# EAGLE design Ethernet_Board (EAGLE 7.7.0)
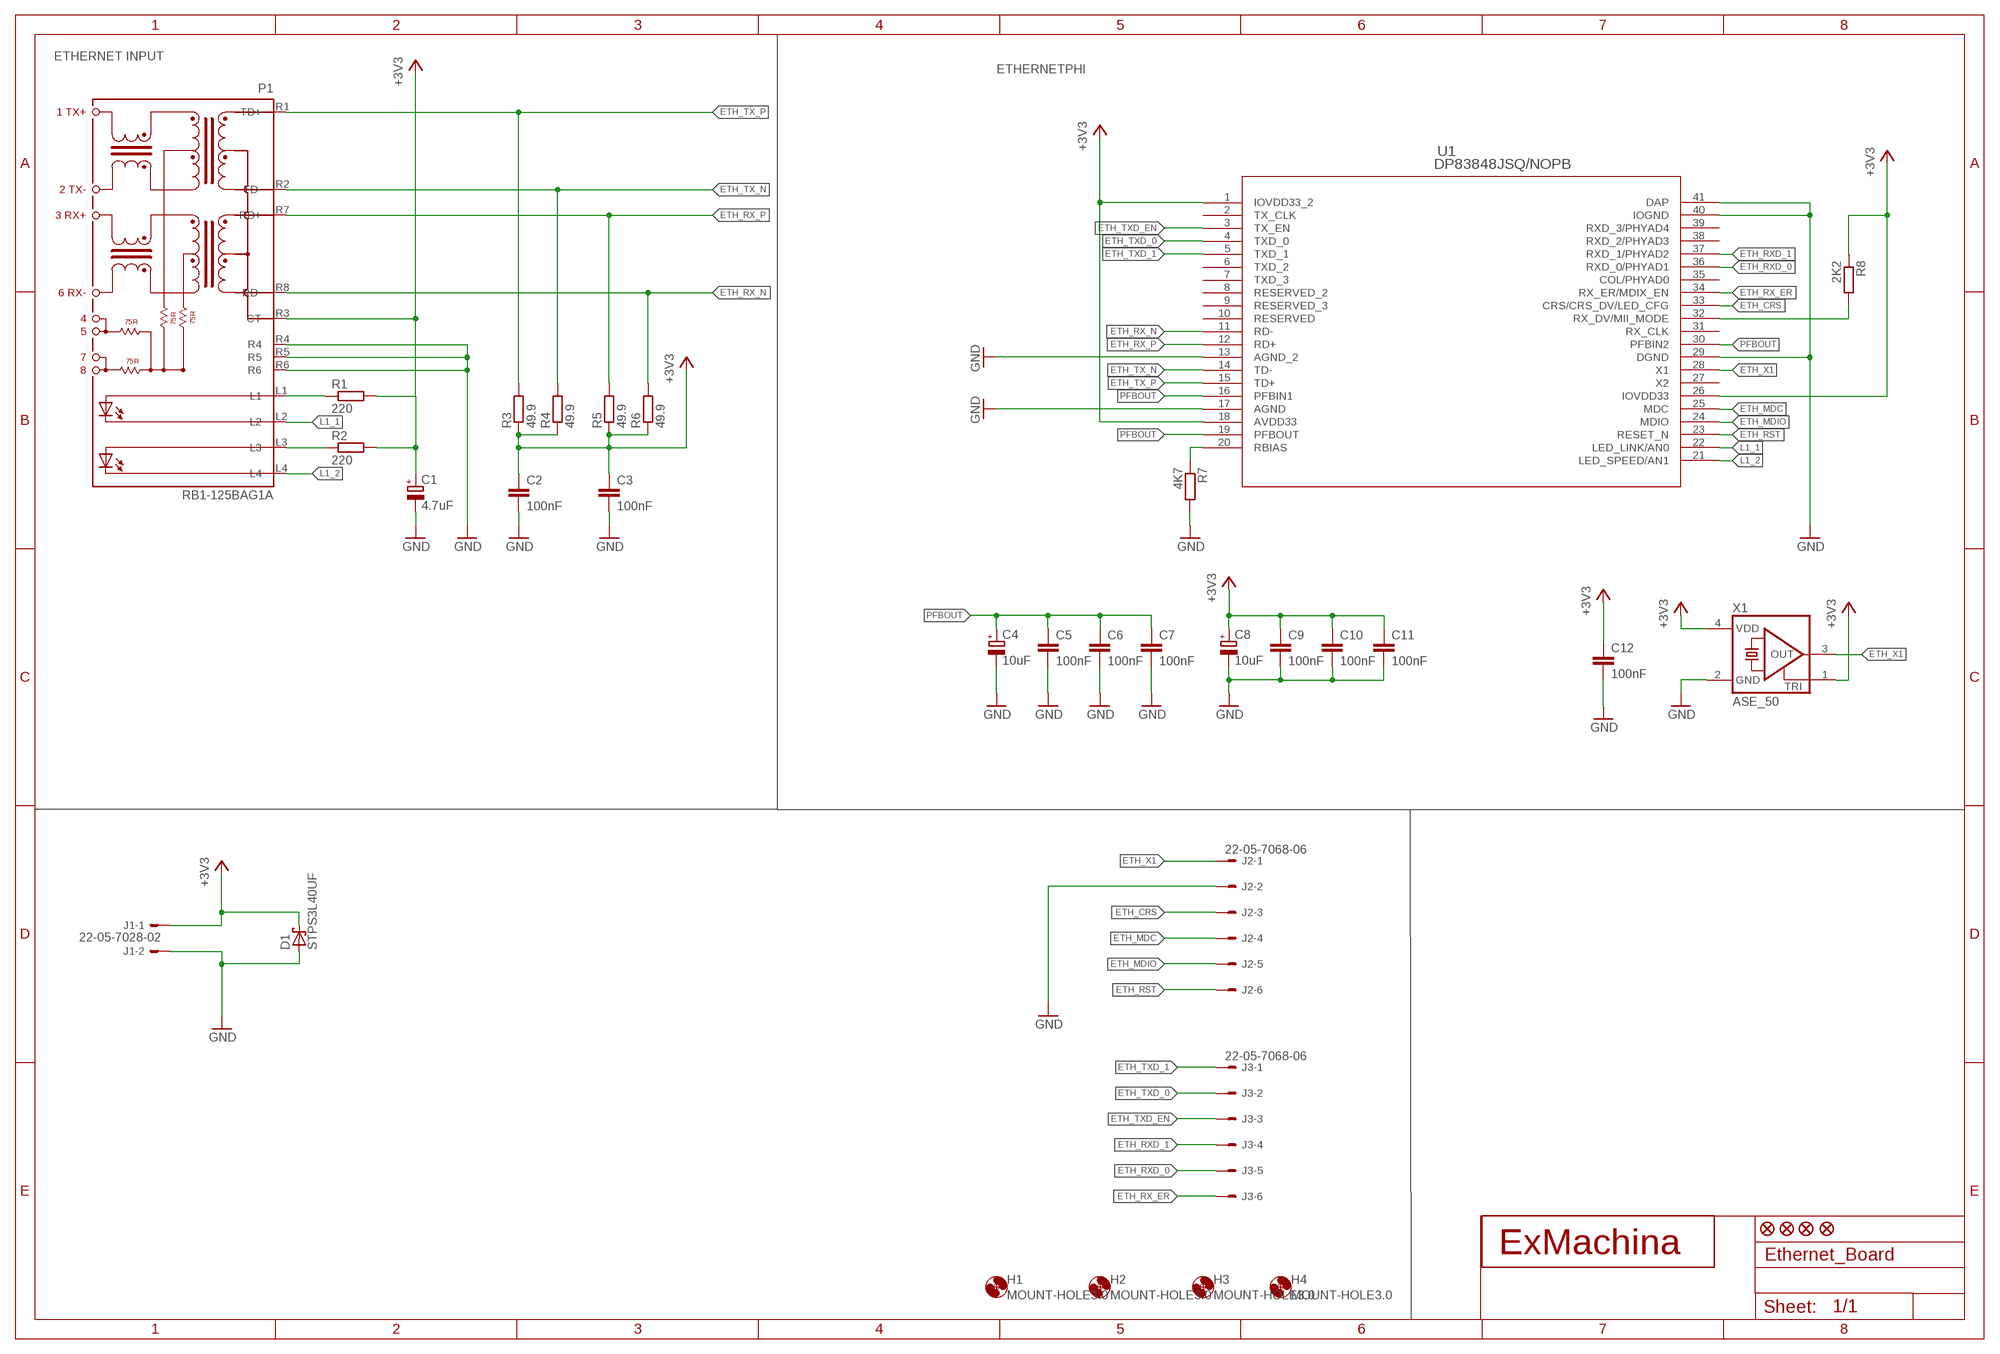
[diagram p0: schematic, sheet 1]

## Parts
C1  4.7uF  CPOL-EUCT3216  [CT3216]
C2  100nF  C-EUC0603  [C0603]
C3  100nF  C-EUC0603  [C0603]
C4  10uF  CPOL-EUCT3216  [CT3216]
C5  100nF  C-EUC0603  [C0603]
C6  100nF  C-EUC0603  [C0603]
C7  100nF  C-EUC0603  [C0603]
C8  10uF  CPOL-EUCT3216  [CT3216]
C9  100nF  C-EUC0603  [C0603]
C10  100nF  C-EUC0603  [C0603]
C11  100nF  C-EUC0603  [C0603]
C12  100nF  C-EUC0603  [C0603]
D1  STPS3L40UF  [SMB]
H1  MOUNT-HOLE3.0  [3,0]
H2  MOUNT-HOLE3.0  [3,0]
H3  MOUNT-HOLE3.0  [3,0]
H4  MOUNT-HOLE3.0  [3,0]
J1  22-05-7028-02  [7395-02]
J2  22-05-7068-06  [7395-06]
J3  22-05-7068-06  [7395-06]
JP1  FIDUCIAL1X2  [FIDUCIAL-1X2]
JP2  FIDUCIAL1X2  [FIDUCIAL-1X2]
JP3  FIDUCIAL1X2  [FIDUCIAL-1X2]
JP4  FIDUCIAL1X2  [FIDUCIAL-1X2]
P1  RB1-125BAG1A  [WIZNET_RB1-125BAG1A]
R1  220  R-EU_R0603  [R0603]
R2  220  R-EU_R0603  [R0603]
R3  49.9  R-EU_R0603  [R0603]
R4  49.9  R-EU_R0603  [R0603]
R5  49.9  R-EU_R0603  [R0603]
R6  49.9  R-EU_R0603  [R0603]
R7  4K7  R-EU_R0603  [R0603]
R8  2K2  R-EU_R0603  [R0603]
T1  EXMACHINA-LOGO-NAME  [EXM-LOGO-BASELINE]
U1  DP83848JSQ/NOPB  [SQA40B]
X1  ASE_50  ASE  [ASE]

## Nets
+3V3 [supply]: C1.+ C2.1 C3.1 C8.+ C9.1 C10.1 C11.1 C12.1 D1.C J1.1 P1.R3(CT) R1.2 R2.2 R3.1 R4.1 R5.1 R6.1 R8.1 U1.1(IOVDD33_2) U1.18(AVDD33) U1.26(IOVDD33) X1.1(TRI) X1.4(VDD)
ETH_CRS [signal]: J2.3 U1.33(CRS/CRS_DV/LED_CFG)
ETH_MDC [signal]: J2.4 U1.25(MDC)
ETH_MDIO [signal]: J2.5 U1.24(MDIO)
ETH_RST [signal]: J2.6 U1.23(RESET_N)
ETH_RX_ER [signal]: J3.6 U1.34(RX_ER/MDIX_EN)
ETH_RX_N [signal]: P1.R8(RD-) R6.2 U1.11(RD-)
ETH_RX_P [signal]: P1.R7(RD+) R5.2 U1.12(RD+)
ETH_RXD_0 [signal]: J3.5 U1.36(RXD_0/PHYAD1)
ETH_RXD_1 [signal]: J3.4 U1.37(RXD_1/PHYAD2)
ETH_TX_N [signal]: P1.R2(TD-) R4.2 U1.14(TD-)
ETH_TX_P [signal]: P1.R1(TD+) R3.2 U1.15(TD+)
ETH_TXD_0 [signal]: J3.2 U1.4(TXD_0)
ETH_TXD_1 [signal]: J3.1 U1.5(TXD_1)
ETH_TXD_EN [signal]: J3.3 U1.3(TX_EN)
ETH_X1 [signal]: J2.1 U1.28(X1) X1.3(OUT)
GND [supply]: C1.- C2.2 C3.2 C4.- C5.2 C6.2 C7.2 C8.- C9.2 C10.2 C11.2 C12.2 D1.A J1.2 J2.2 P1.R4 P1.R5 P1.R6 R7.2 U1.13(AGND_2) U1.17(AGND) U1.29(DGND) U1.40(IOGND) U1.41(DAP) X1.2(GND)
L1_1 [signal]: P1.L2 U1.22(LED_LINK/AN0)
L1_2 [signal]: P1.L4 U1.21(LED_SPEED/AN1)
MII_MODE [signal]: R8.2 U1.32(RX_DV/MII_MODE)
N$4: R7.1 U1.20(RBIAS)
N$8 [signal]: P1.L1 R1.1
N$9 [signal]: P1.L3 R2.1
PFBOUT [signal]: C4.+ C5.1 C6.1 C7.1 U1.16(PFBIN1) U1.19(PFBOUT) U1.30(PFBIN2)
Unconnected: U1.2(TX_CLK) U1.6(TXD_2) U1.7(TXD_3) U1.8(RESERVED_2) U1.9(RESERVED_3) U1.10(RESERVED) U1.27(X2) U1.31(RX_CLK) U1.35(COL/PHYAD0) U1.38(RXD_2/PHYAD3) U1.39(RXD_3/PHYAD4)

## Notes on the sheet
- ETHERNET INPUT
- ETHERNETPHI

## Library data of the parts
C1 = rcl:CPOL-EU: POLARIZED CAPACITOR, European symbol; MPN: F931A475MAA; OC_NEWARK: 58R3271
C2 C3 C5-C7 C9-C12 = rcl:C-EU: CAPACITOR, European symbol; MPN: MC0603B104K250CT; OC_NEWARK: 06R4925
C4 C8 = rcl:CPOL-EU: POLARIZED CAPACITOR, European symbol; MPN: F931A106MAA; OC_NEWARK: 58R3260
D1 = diode:STPS3L40?; MP: STMICROELECTRONICS; MPN: STPS3L40UF; OC_FARNELL: 2341599; OC_NEWARK: 06X0873
H1-H4 = holes:MOUNT-HOLE: MOUNTING HOLE with drill center marker; OC_NEWARK: unknown
J1 = con-molex:22-?-02: CONNECTOR wire to board 2.54 mm (.1 inch) pitch header; MPN: 22-05-7028; OC_FARNELL: 9731601; OC_NEWARK: 25M1728
J2 J3 = con-molex:22-?-06: CONNECTOR wire to board 2.54 mm (.1 inch) pitch header; MPN: 22-05-7068; OC_FARNELL: unknown; OC_NEWARK: 25M1733
JP1-JP4 = SparkFun:FIDUCIAL: Fiducial Alignment Points Various fiducial points for machine vision alignment.; OC_NEWARK: unknown
P1 = con-wiznet:RB1-125BAG1A: Accessory RJ-45 With Transformer Connector - UDE; OC_NEWARK: unknown
R1 R2 = rcl:R-EU_: RESISTOR, European symbol; MPN: MCMR06X2200FTL; OC_NEWARK: 86T3577
R3-R6 = rcl:R-EU_: RESISTOR, European symbol; MPN: MCMR06X49R9FTL; OC_NEWARK: 86T3659
R7 = rcl:R-EU_: RESISTOR, European symbol; MPN: MCMR06X4701FTL; OC_NEWARK: 86T3649
R8 = rcl:R-EU_: RESISTOR, European symbol; MPN: MCMR06X2201FTL; OC_NEWARK: 86T3578
T1 = exmachina:EXMACHINA-LOGO; OC_NEWARK: unknown
U1 = textas:DP83848JSQ/NOPB; COPYRIGHT: Copyright C 2015 Accelerated Designs. All rights reserved; MANUFACTURER_PART_NUMBER: dp83848jsqnopb; MPN: DP83848JSQ/NOPB; OC_NEWARK: 96W2841; VENDOR: National Semiconductor
X1 = crystal:ASE: 3.3Vdc CMOS SMD CRYSTAL CLOCK OSCILLATOR SOurce: www.abracon.com; MPN: ASE-50.000MHZ-LC-T; OC_FARNELL: unknown; OC_NEWARK: 84R2105

## Net classes
1 signal: width 0.178 mm, drill 0.35 mm
2 supply: width 0.008 mm, drill 0.5 mm

## Board
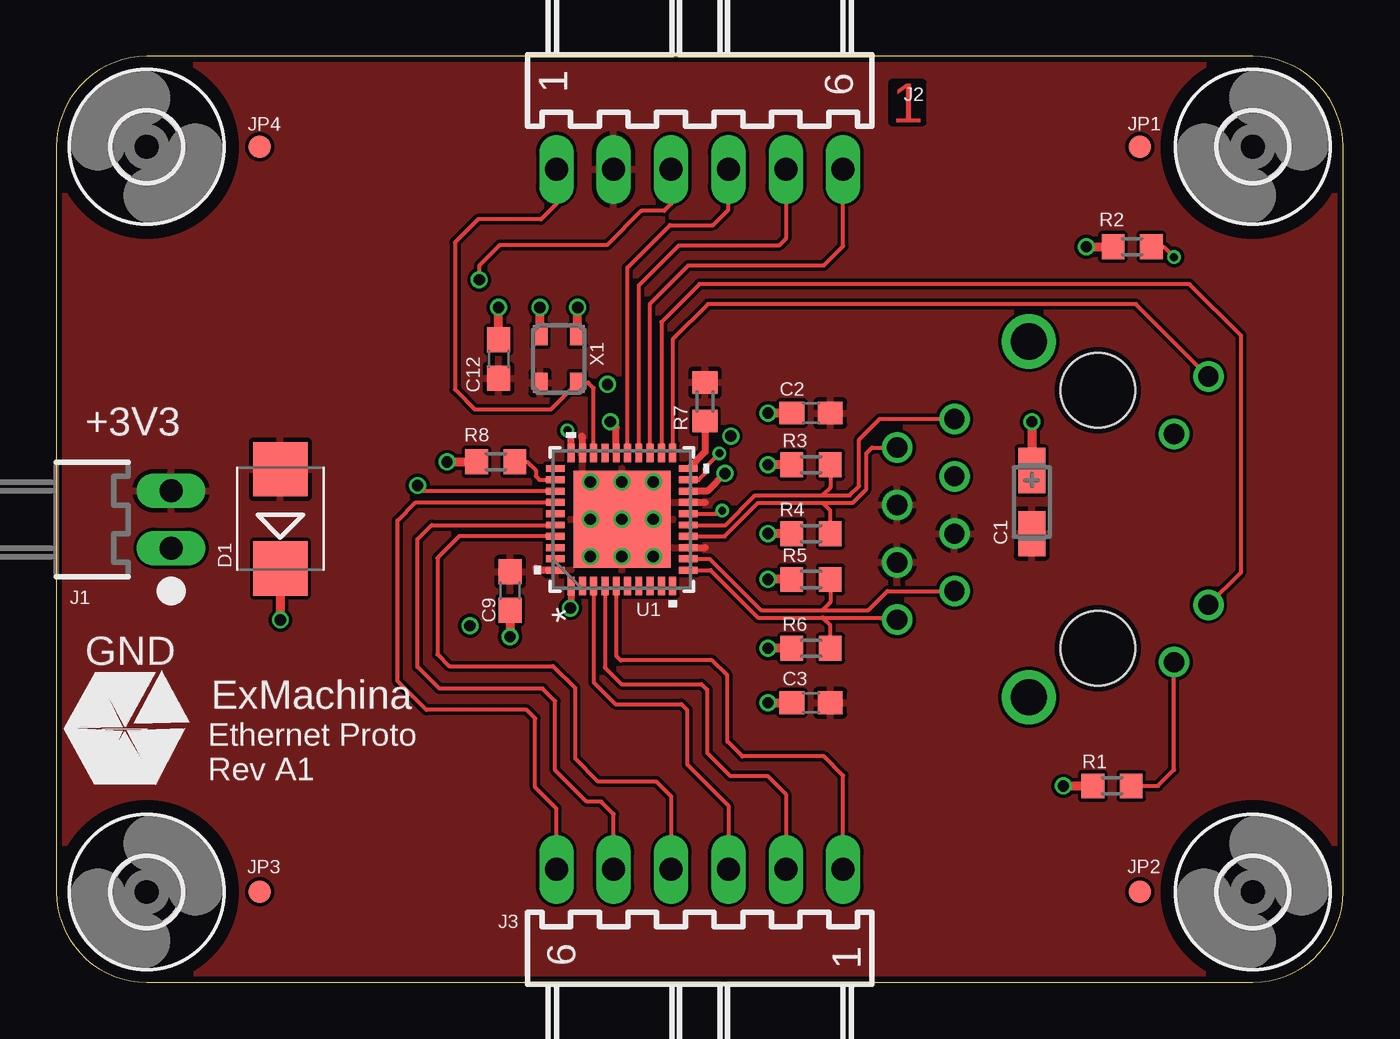
[diagram p1: board, top side]
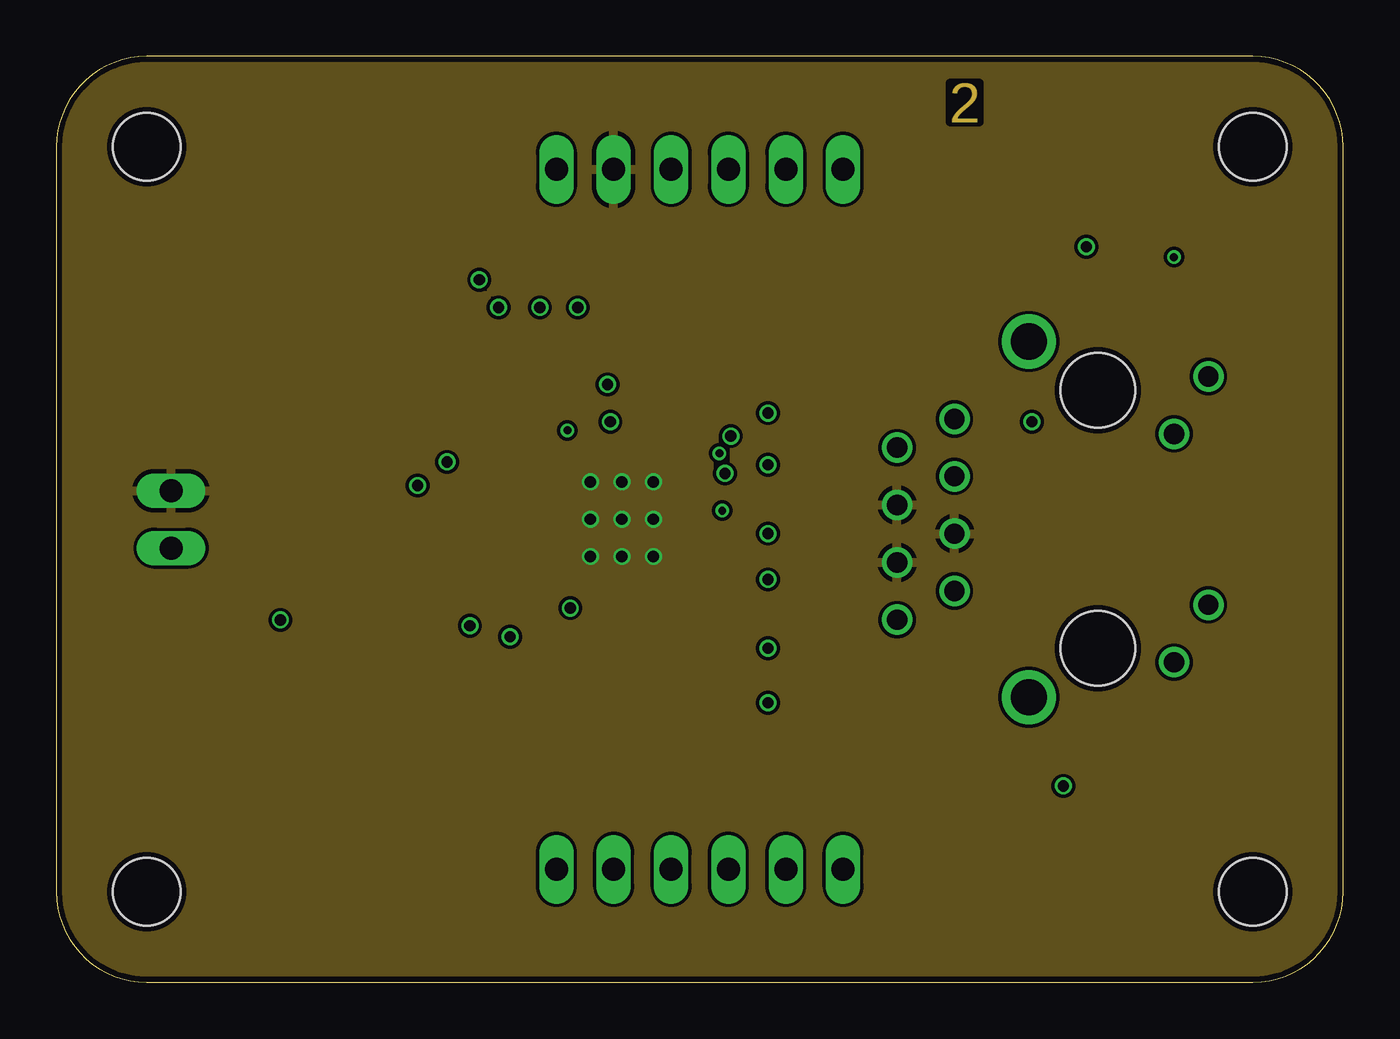
[diagram p2: board, inner layer Route2]
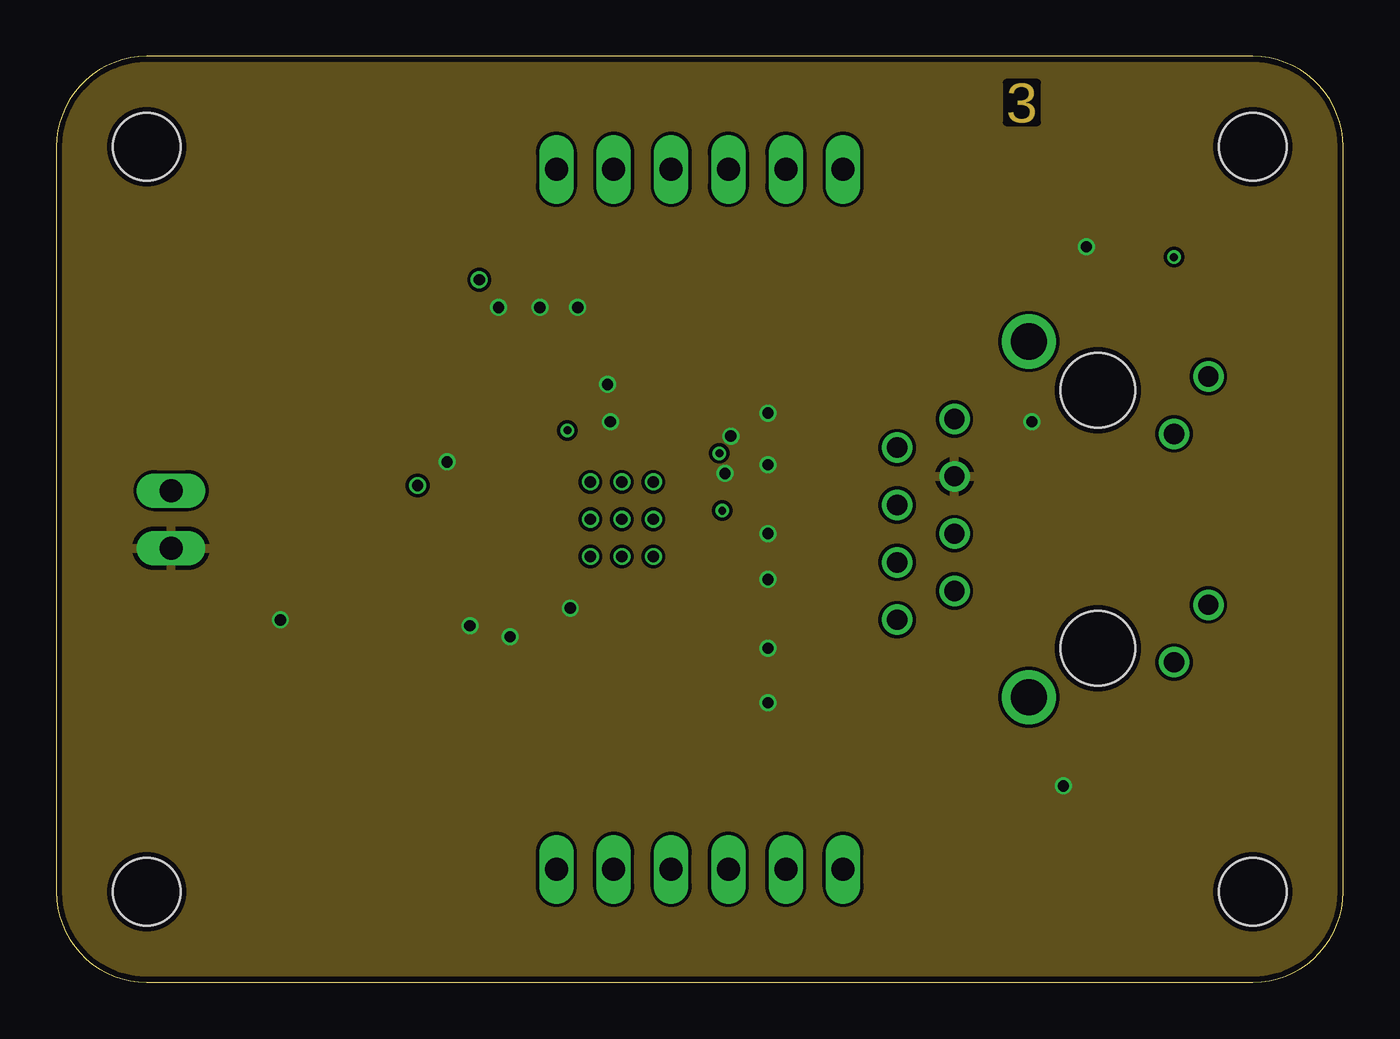
[diagram p3: board, inner layer Route15]
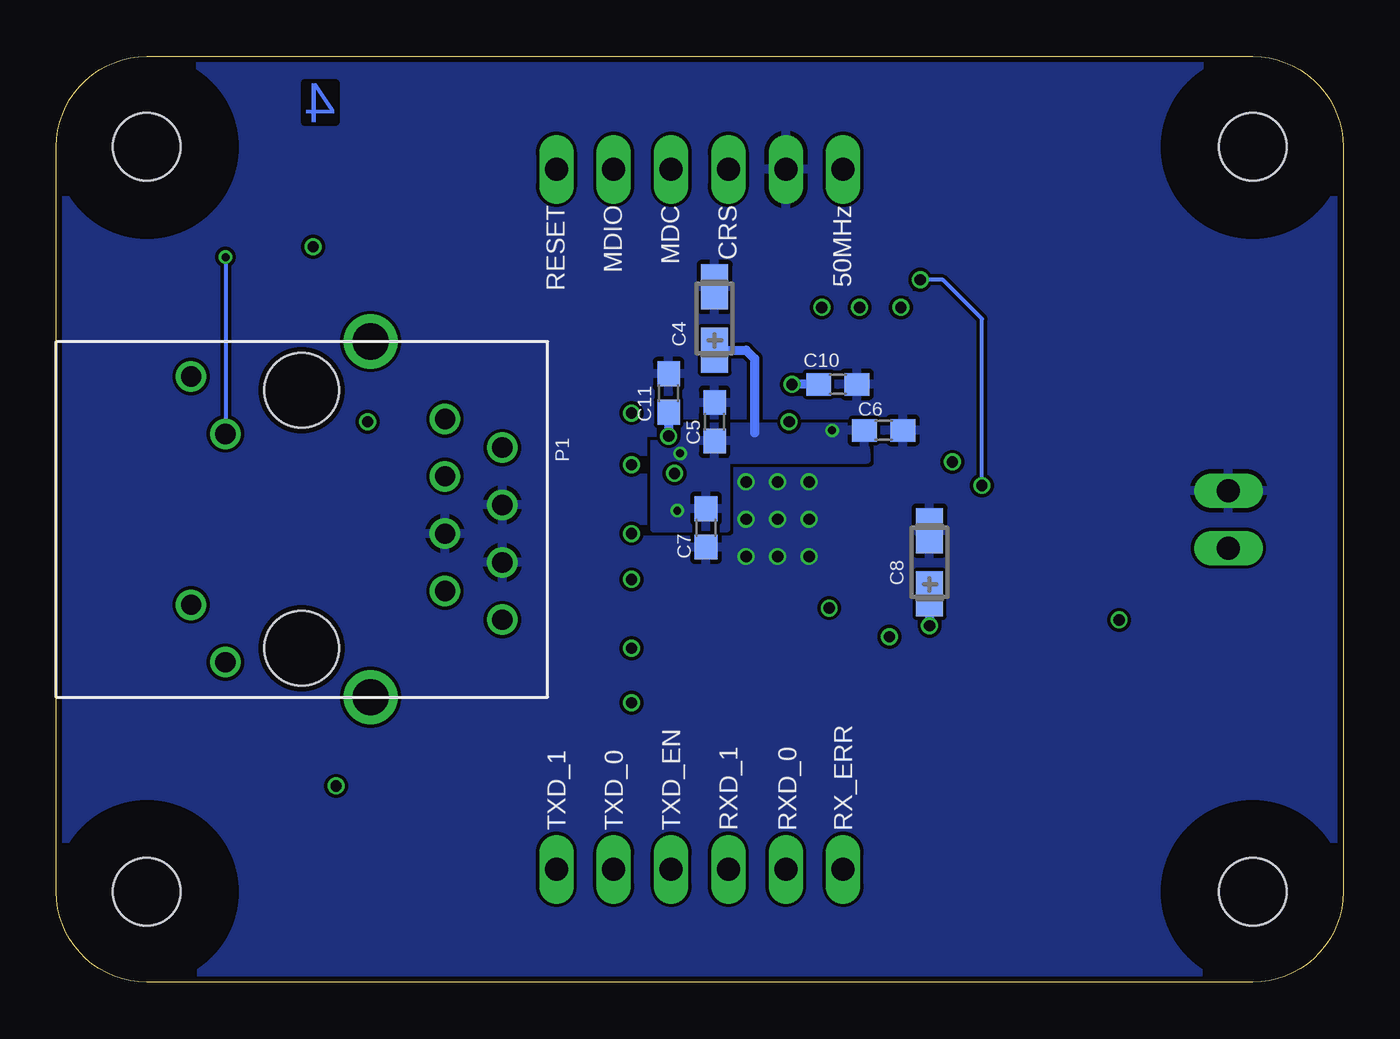
[diagram p4: board, bottom side, seen from below]

Size 57 x 41 mm. Coordinates in mm from the lower left corner, seen from the top.
Outline: 57,4 57,37 arc90 53,41 4,41 arc90 0,37 0,4 arc90 4,0 53,0 arc90 57,4
Copper layers (1+2*15+16): Top 0.018mm / dielectric 0.36mm / Route2 0.035mm / dielectric 0.71mm / Route15 0.035mm / dielectric 0.2mm / Bottom 0.018mm
Design rules "eC_4Layer_PClass6_BaseCopperO18-I35_eCDefault *": minimum track width 0.15mm, minimum drill 0.35mm, track to track 0.15mm, track to pad 0.15mm, pad to pad 0.15mm, via to via 0.15mm, smd to smd 0mil, copper to edge 0.25mm, drill to drill 0.35mm, minimum pad ring 0.175mm, minimum via ring 0.125mm, stop-mask expansion 0mil, vias tented up to drill 0.45mm, thermal gap 0.2mm

### Footprints (pad centres in the part's own frame; a part is rotated, then mirrored left to right if it is on the bottom)
CT3216 = smd 2 x 1.2: + -1.4,0; - 1.4,0
C0603 = smd 1.1 x 1: 1 -0.85,0; 2 0.85,0
SMB = smd 2.4 x 2.4: A 2.2,0; C -2.2,0
3,0 = hole 3: 0,0
7395-02 = drill 1.016 long: 1 1.27,0; 2 -1.27,0
7395-06 = drill 1.016 long: 1 6.35,0; 2 3.81,0; 3 1.27,0; 4 -1.27,0; 5 -3.81,0; 6 -6.35,0
FIDUCIAL-1X2 = smd 1 x 1: 1 0,0
WIZNET_RB1-125BAG1A = drill 0.9: L1 6.325,-3.38; L2 3.784,-4.899; L3 -3.786,-3.379; L4 -6.325,-4.9 | drill 0.9 pad 1.3: R1 -4.446,6.349; R2 -3.176,8.889; R3 -1.906,6.349; R4 -0.636,8.889; R5 0.634,6.349; R6 1.904,8.889; R7 3.174,6.349; R8 4.444,8.889 | drill 1.6 pad 2.184: S1 -7.876,3.049; S2 7.874,3.049 | hole 3.3: 5.714,-0.001; -5.716,-0.001
R0603 = smd 1 x 1.1: 1 -0.85,0; 2 0.85,0
SQA40B = smd 0.813 x 0.305: 1 -2.946,2.25; 2 -2.946,1.75; 3 -2.946,1.25; 4 -2.946,0.75; 5 -2.946,0.25; 6 -2.946,-0.25; 7 -2.946,-0.75; 8 -2.946,-1.25; 9 -2.946,-1.75; 10 -2.946,-2.25; 21 2.946,-2.25; 22 2.946,-1.75; 23 2.946,-1.25; 24 2.946,-0.75; 25 2.946,-0.25; 26 2.946,0.25; 27 2.946,0.75; 28 2.946,1.25; 29 2.946,1.75; 30 2.946,2.25 | smd 0.305 x 0.813: 11 -2.25,-2.946; 12 -1.75,-2.946; 13 -1.25,-2.946; 14 -0.75,-2.946; 15 -0.25,-2.946; 16 0.25,-2.946; 17 0.75,-2.946; 18 1.25,-2.946; 19 1.75,-2.946; 20 2.25,-2.946; 31 2.25,2.946; 32 1.75,2.946; 33 1.25,2.946; 34 0.75,2.946; 35 0.25,2.946; 36 -0.25,2.946; 37 -0.75,2.946; 38 -1.25,2.946; 39 -1.75,2.946; 40 -2.25,2.946 | smd 4.3 x 4.3: 41 0,0
ASE = smd 0.9 x 0.65: 1 -1.05,-0.825; 2 1.05,-0.825; 3 1.05,0.825; 4 -1.05,0.825

### Placement (x,y rotation side)
C1  43.21,21.27 270 top
C2  33.43,25.2 0 top
C3  33.43,12.38 0 top
C4  27.84,29.39 90 bottom
C5  27.84,24.82 90 bottom
C6  20.35,24.44 0 bottom
C7  28.23,20.12 270 bottom
C8  18.32,18.6 90 bottom
C9  20.1,17.33 90 top
C10  22.38,26.47 0 bottom
C11  29.88,26.09 90 bottom
C12  19.59,27.6 270 top
D1  9.92,20.52 90 top
H1  53,4 0 top
H2  4,4 0 top
H3  53,37 0 top
H4  4,37 270 top
J1  5.08,20.5 270 top
J2  28.5,36 180 top
J3  28.5,5 0 top
JP1  48,37 270 top
JP2  48,4 270 top
JP3  9,4 270 top
JP4  9,37 270 top
P1  46.13,20.5 270 bottom
R1  46.77,8.69 180 top
R2  47.66,32.57 180 top
R3  33.43,22.92 0 top
R4  33.43,19.87 0 top
R5  33.43,17.84 0 top
R6  33.43,14.79 0 top
R7  28.73,25.71 90 top
R8  19.46,23.05 0 top
T1  3.03,11.22 0 top
U1  25.05,20.5 90 top
X1  22.26,27.6 270 top

### Tracks (layer width: path | path; a pad name or v marks a point on that pad's centre or on a via)
+3V3  (via drill 0.5)
  Top 0.178: U1.18 28.02,21.77 | 22.8,16.6 v22.76,16.57
  Top 0.305: U1.1 22.8,16.6 | U1.26 24.8,24.57 v24.54,24.82 | v29.62,22.54 28.84,21.75 U1.18
  Top 0.406: R3.1 v31.53,22.92 | R4.1 v31.53,19.87 | R5.1 v31.53,17.84 | R6.1 v31.53,14.79 | X1.4 23.08,29.87 v23.09,29.89 | X1.1 21.43,29.87 v21.42,29.89 | C12.1 v19.59,29.89 | D1.C v9.92,16.05 | v17.3,23.05 R8.1 | v45.62,32.57 R2.2 | v44.61,8.69 R1.2 | v43.21,24.82 C1.+ | v31.53,12.38 C3.1 | C2.1 v31.53,25.2 | C9.1 v20.1,15.3
  Bottom 0.406: C10.1 v24.41,26.47 | C11.1 v29.88,24.19 | C8.+ v18.32,15.79
  pour Route15: -6.35,49.89 -6.35,-18.69 62.61,-18.69 62.61,49.89
ETH_CRS  (via drill 0.5)
  Top 0.178: U1.33 16.25,21.75 v16,22 | J2.3 27.23,34.47 26.92,34.16 25.91,34.16 24.38,32.64 19.64,32.64 18.73,31.73 v18.73,31.11
  Bottom 0.178: v16,22 16,29.38 17.73,31.11 v18.73,31.11
ETH_MDC
  Top 0.178: U1.25 25.3,31.65 27.18,33.53 29.08,33.53 29.77,34.22 J2.4
ETH_MDIO
  Top 0.178: U1.24 25.8,30.86 27.56,32.62 32,32.62 32.31,32.93 J2.5
ETH_RST
  Top 0.178: U1.23 26.3,30.05 28,31.75 34,31.75 34.85,32.6 J2.6
ETH_RX_ER
  Top 0.178: U1.34 15.92,21.25 15.11,20.45 15.11,13.34 16.38,12.06 20.83,12.06 21.21,11.68 21.21,8.64 22.15,7.7 J3.6
ETH_RX_N
  Top 0.178: 33.94,16.15 31.08,16.15 28.98,18.25 U1.11 | 33.94,16.15 37.15,16.15 P1.R8 | R6.2 34.28,15.81 33.94,16.15
ETH_RX_P
  Top 0.178: 33.94,16.48 31.21,16.48 28.94,18.75 U1.12 | 33.94,16.48 35.97,16.48 36.82,17.33 P1.R7 | R5.2 34.28,16.82 33.94,16.48
ETH_RXD_0
  Top 0.178: U1.36 16.63,20.25 16,19.62 16,13.97 16.97,13 21.54,13 22.1,12.45 22.1,9.4 23.5,8 24.13,8 24.69,7.44 J3.5
ETH_RXD_1
  Top 0.178: U1.37 17.83,19.75 16.88,18.8 16.88,14.53 17.4,14 22,14 22.99,13.01 22.99,9.91 24,8.89 26.57,8.89 27.23,8.23 J3.4
ETH_TX_N
  Top 0.178: P1.R2 36.13,23.68 35.88,23.43 35.88,21.83 35.28,21.23 33.94,21.23 | U1.14 29.61,19.75 31.09,21.23 33.94,21.23 | R4.2 34.28,20.89 33.94,21.23
ETH_TX_P
  Top 0.178: P1.R1 36.48,24.95 35.55,24.02 35.55,21.97 35.14,21.56 33.94,21.56 | U1.15 29.64,20.25 30.95,21.56 33.94,21.56 | R3.2 34.28,21.9 33.94,21.56
ETH_TXD_0
  Top 0.178: U1.4 24.3,13.93 25.02,13.21 28.57,13.21 28.83,12.95 28.83,10.16 29.84,9.14 31.5,9.14 32.31,8.33 J3.2
ETH_TXD_1
  Top 0.178: U1.5 24.8,14.45 25,14.25 29.05,14.25 29.72,13.59 29.72,10.67 30.39,10 34,10 34.85,9.15 J3.1
ETH_TXD_EN
  Top 0.178: U1.3 23.8,13.28 24.77,12.32 27.69,12.32 27.94,12.06 27.94,9.65 29.77,7.82 J3.3
ETH_X1
  Top 0.178: U1.28 23.8,26.31 23.56,26.55 X1.3 21.89,25.36 18.54,25.36 17.65,26.25 17.65,32.77 18.67,33.78 21.46,33.78 22.15,34.47 J2.1
GND  (via drill 0.5)
  Top 0.305: U1.17 28.75,21.25 | U1.13 28.75,19.25 | U1.40 21.34,18.25 21.24,18.35 | U1.29 23.3,24.16 23.27,24.19
  other vias: 26.45,22.16 25.05,22.16 23.65,22.16 26.45,20.5 25.05,20.5 23.65,20.5 26.45,18.85 25.05,18.85 23.65,18.85
  pour Bottom (rank 2): -7.62,51.16 -7.62,-19.96 63.88,-19.96 63.88,51.16
  pour Top: -3.81,-16.15 -3.81,47.35 60.07,47.35 60.07,-16.15
  pour Route2: -5.08,48.62 -5.08,-17.42 61.34,-17.42 61.34,48.62
L1_1
  Top 0.178: P1.L2 52.48,18.17 52.48,28.63 50.2,30.92 28.48,30.92 26.8,29.24 U1.22
L1_2
  Top 0.178: P1.L4 47.83,30.03 28.86,30.03 27.3,28.47 U1.21
MII_MODE
  Top 0.178: R8.2 20.86,23.05 21.24,22.66 21.24,22.41 21.4,22.25 U1.32
N$4
  Top 0.305: R7.1 28.73,23.49 U1.20
N$8
  Top 0.178: R1.1 48.8,8.69 49.51,9.41 P1.L1
N$9  (via drill 0.35)
  Top 0.178: R2.1 49.05,32.57 v49.51,32.11
  Bottom 0.178: v49.51,32.11 P1.L3
PFBOUT  (via drill 0.35)
  Top 0.178: U1.16 29.36,20.75 v29.5,20.89 | U1.19 28.45,22.25 28.73,22.54 28.73,22.79 v29.37,23.43
  Top 0.305: U1.30 22.8,24.28 v22.64,24.44
  Bottom 0.406: C4.+ 26.44,28 26.07,27.62 26.07,24.32
  pour Bottom: 27.34,23.17 21.11,23.17 21.11,23.3 21.24,24.57 30.51,24.57 30.51,20.12 27.34,20.12

### Text on the board
Top: 1
Route2: 2
Route15: 3
Bottom: 4
tPlace: +3V3 | GND | Ethernet Proto / Rev A1
bPlace: 50MHz | CRS | MDC | MDIO | RESET | RX_ERR | RXD_0 | RXD_1 | TXD_EN | TXD_0 | TXD_1